# EAGLE schematic breakout-v2 (EAGLE 7.5.0)
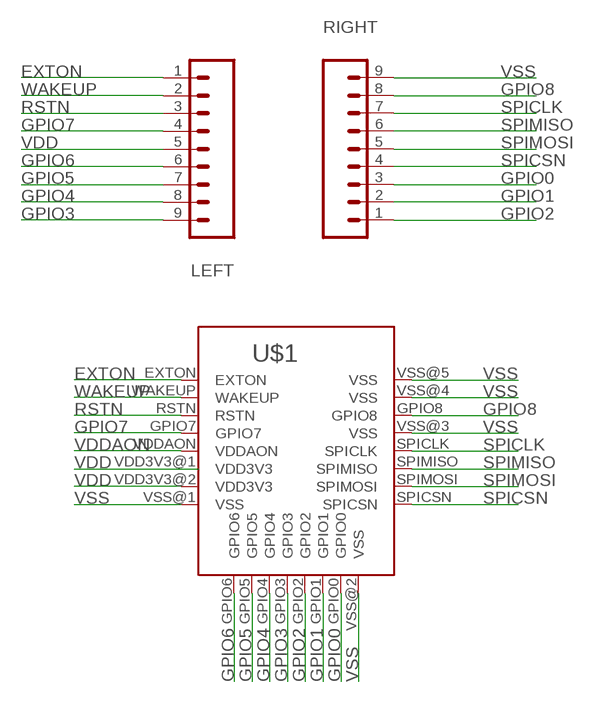
[diagram p0: schematic, sheet 1]

## Parts
LEFT  M09  [1X09]
RIGHT  M09  [1X09]
U$1  DWM1000  [DWM1000]

## Nets
EXTON: LEFT.1 U$1.EXTON
GPIO0: RIGHT.3 U$1.GPIO0
GPIO1: RIGHT.2 U$1.GPIO1
GPIO2: RIGHT.1 U$1.GPIO2
GPIO3: LEFT.9 U$1.GPIO3
GPIO4: LEFT.8 U$1.GPIO4
GPIO5: LEFT.7 U$1.GPIO5
GPIO6: LEFT.6 U$1.GPIO6
GPIO7: LEFT.4 U$1.GPIO7
GPIO8: RIGHT.8 U$1.GPIO8
RSTN: LEFT.3 U$1.RSTN
SPICLK: RIGHT.7 U$1.SPICLK
SPICSN: RIGHT.4 U$1.SPICSN
SPIMISO: RIGHT.6 U$1.SPIMISO
SPIMOSI: RIGHT.5 U$1.SPIMOSI
VDD: LEFT.5 U$1.VDD3V3@2(VDD3V3)
VDDAON: U$1.VDDAON
VSS: RIGHT.9 U$1.VSS@1(VSS) U$1.VSS@2(VSS) U$1.VSS@3(VSS) U$1.VSS@4(VSS) U$1.VSS@5(VSS)
WAKEUP: LEFT.2 U$1.WAKEUP

## Power pins joined to a net without a drawn wire
VDD3V3: U$1.VDD3V3@1(VDD3V3)

## Library data of the parts
LEFT RIGHT = SparkFun-Connectors:M09: Header 9 Standard 9-pin 0.1" header. Use with straight break away headers (SKU : PRT-00116), right angle break away headers (PRT-00553), swiss pins (PRT-00743), machine pins (PRT-00117), and female headers (PRT-00115).
U$1 = myParts:DWM1000